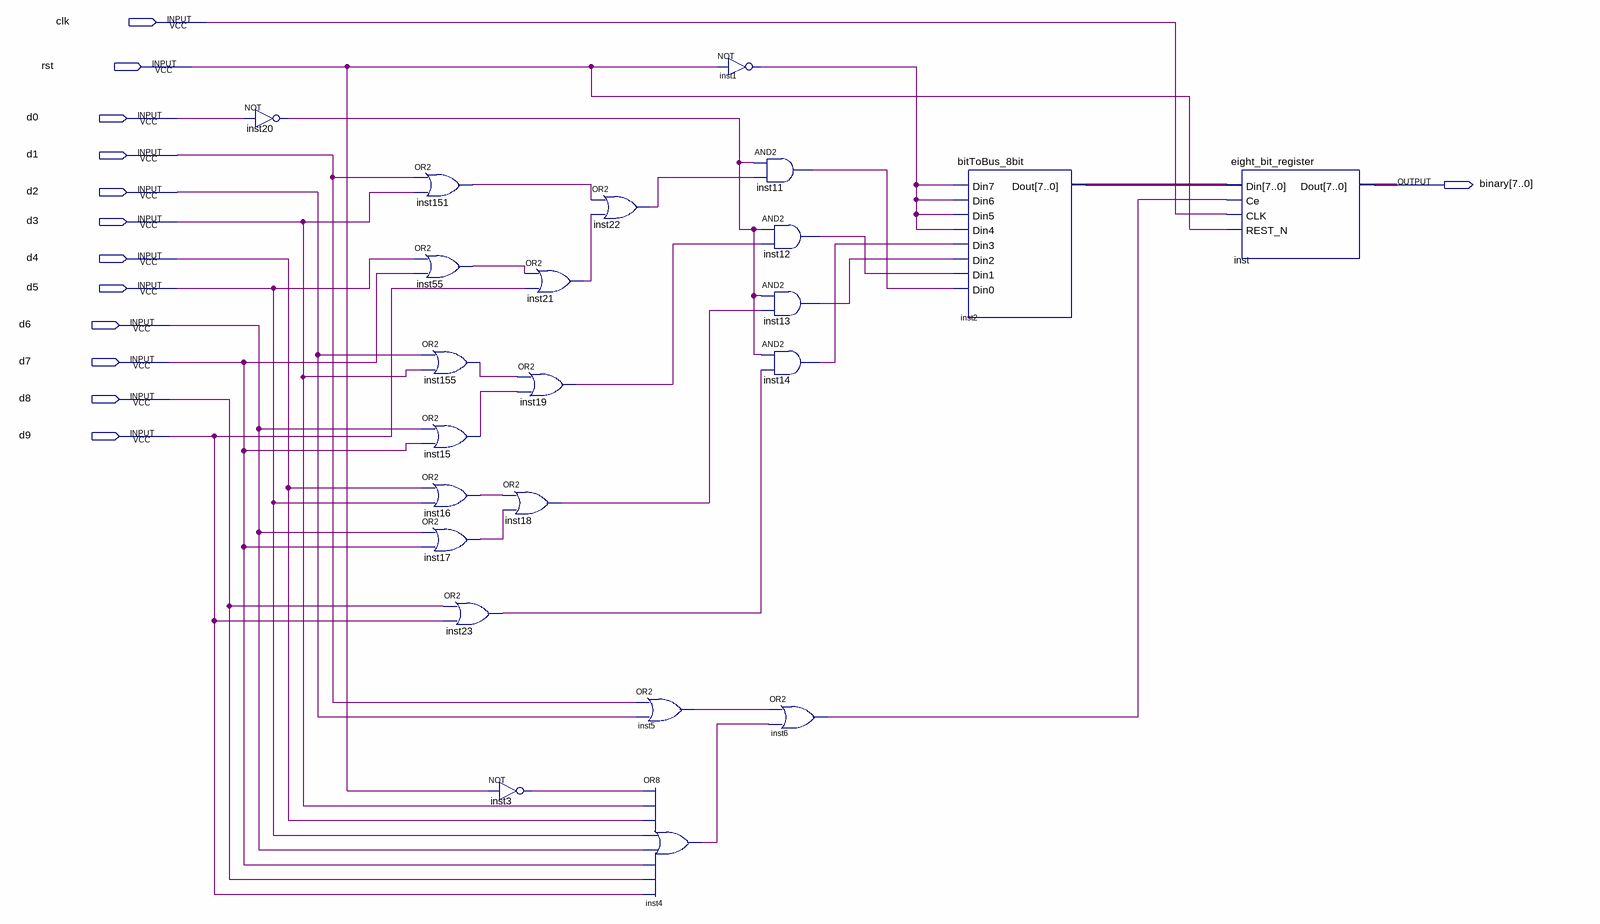
[diagram p0: schematic sheet]
// Quartus schematic d2b_8bit.bdf as structural Verilog: 23 symbols, 13 pins
module d2b_8bit (
  input  clk,
  input  rst,
  input  d0,
  input  d1,
  input  d2,
  input  d3,
  input  d4,
  input  d5,
  input  d6,
  input  d7,
  input  d8,
  input  d9,
  output [7:0] binary
);

  wire inst1_out, inst3_out, inst4_out, inst5_out, inst6_out, inst11_out, inst12_out, inst13_out, inst14_out,
       inst15_out, inst16_out, inst17_out, inst18_out, inst19_out, inst20_out, inst21_out, inst22_out,
       inst23_out, inst55_out, inst151_out, inst155_out;
  wire [7:0] inst2_dout;

  not inst20 (inst20_out, d0);
  or inst151 (inst151_out, d1, d3);
  or inst55 (inst55_out, d5, d7);
  or inst155 (inst155_out, d2, d3);
  or inst15 (inst15_out, d6, d7);
  or inst16 (inst16_out, d4, d5);
  or inst17 (inst17_out, d6, d7);
  or inst23 (inst23_out, d8, d9);
  or inst21 (inst21_out, inst55_out, d9);
  or inst19 (inst19_out, inst155_out, inst15_out);
  or inst18 (inst18_out, inst16_out, inst17_out);
  not inst3 (inst3_out, rst);
  or inst22 (inst22_out, inst151_out, inst21_out);
  or inst5 (inst5_out, d1, d2);
  or inst4 (inst4_out, inst3_out, d3, d4, d5, d6, d7, d8, d9);
  not inst1 (inst1_out, rst);
  and inst11 (inst11_out, inst20_out, inst22_out);
  and inst12 (inst12_out, inst20_out, inst19_out);
  and inst13 (inst13_out, inst20_out, inst18_out);
  and inst14 (inst14_out, inst20_out, inst23_out);
  or inst6 (inst6_out, inst5_out, inst4_out);
  bitToBus_8bit inst2 (
    .Din7(inst1_out), .Din6(inst1_out), .Din5(inst1_out), .Din4(inst1_out), .Din3(inst14_out),
    .Din2(inst13_out), .Din1(inst12_out), .Din0(inst11_out), .Dout(inst2_dout));
  eight_bit_register inst (.Din(inst2_dout), .Ce(inst6_out), .CLK(clk), .REST_N(rst), .Dout(binary));
endmodule
